# EasyEDA Pro project ProPrj_&lt;开源&gt;牧田款工具锂电池包主动均衡保护板_2024-07-21.epro

# Schematic Schematic1
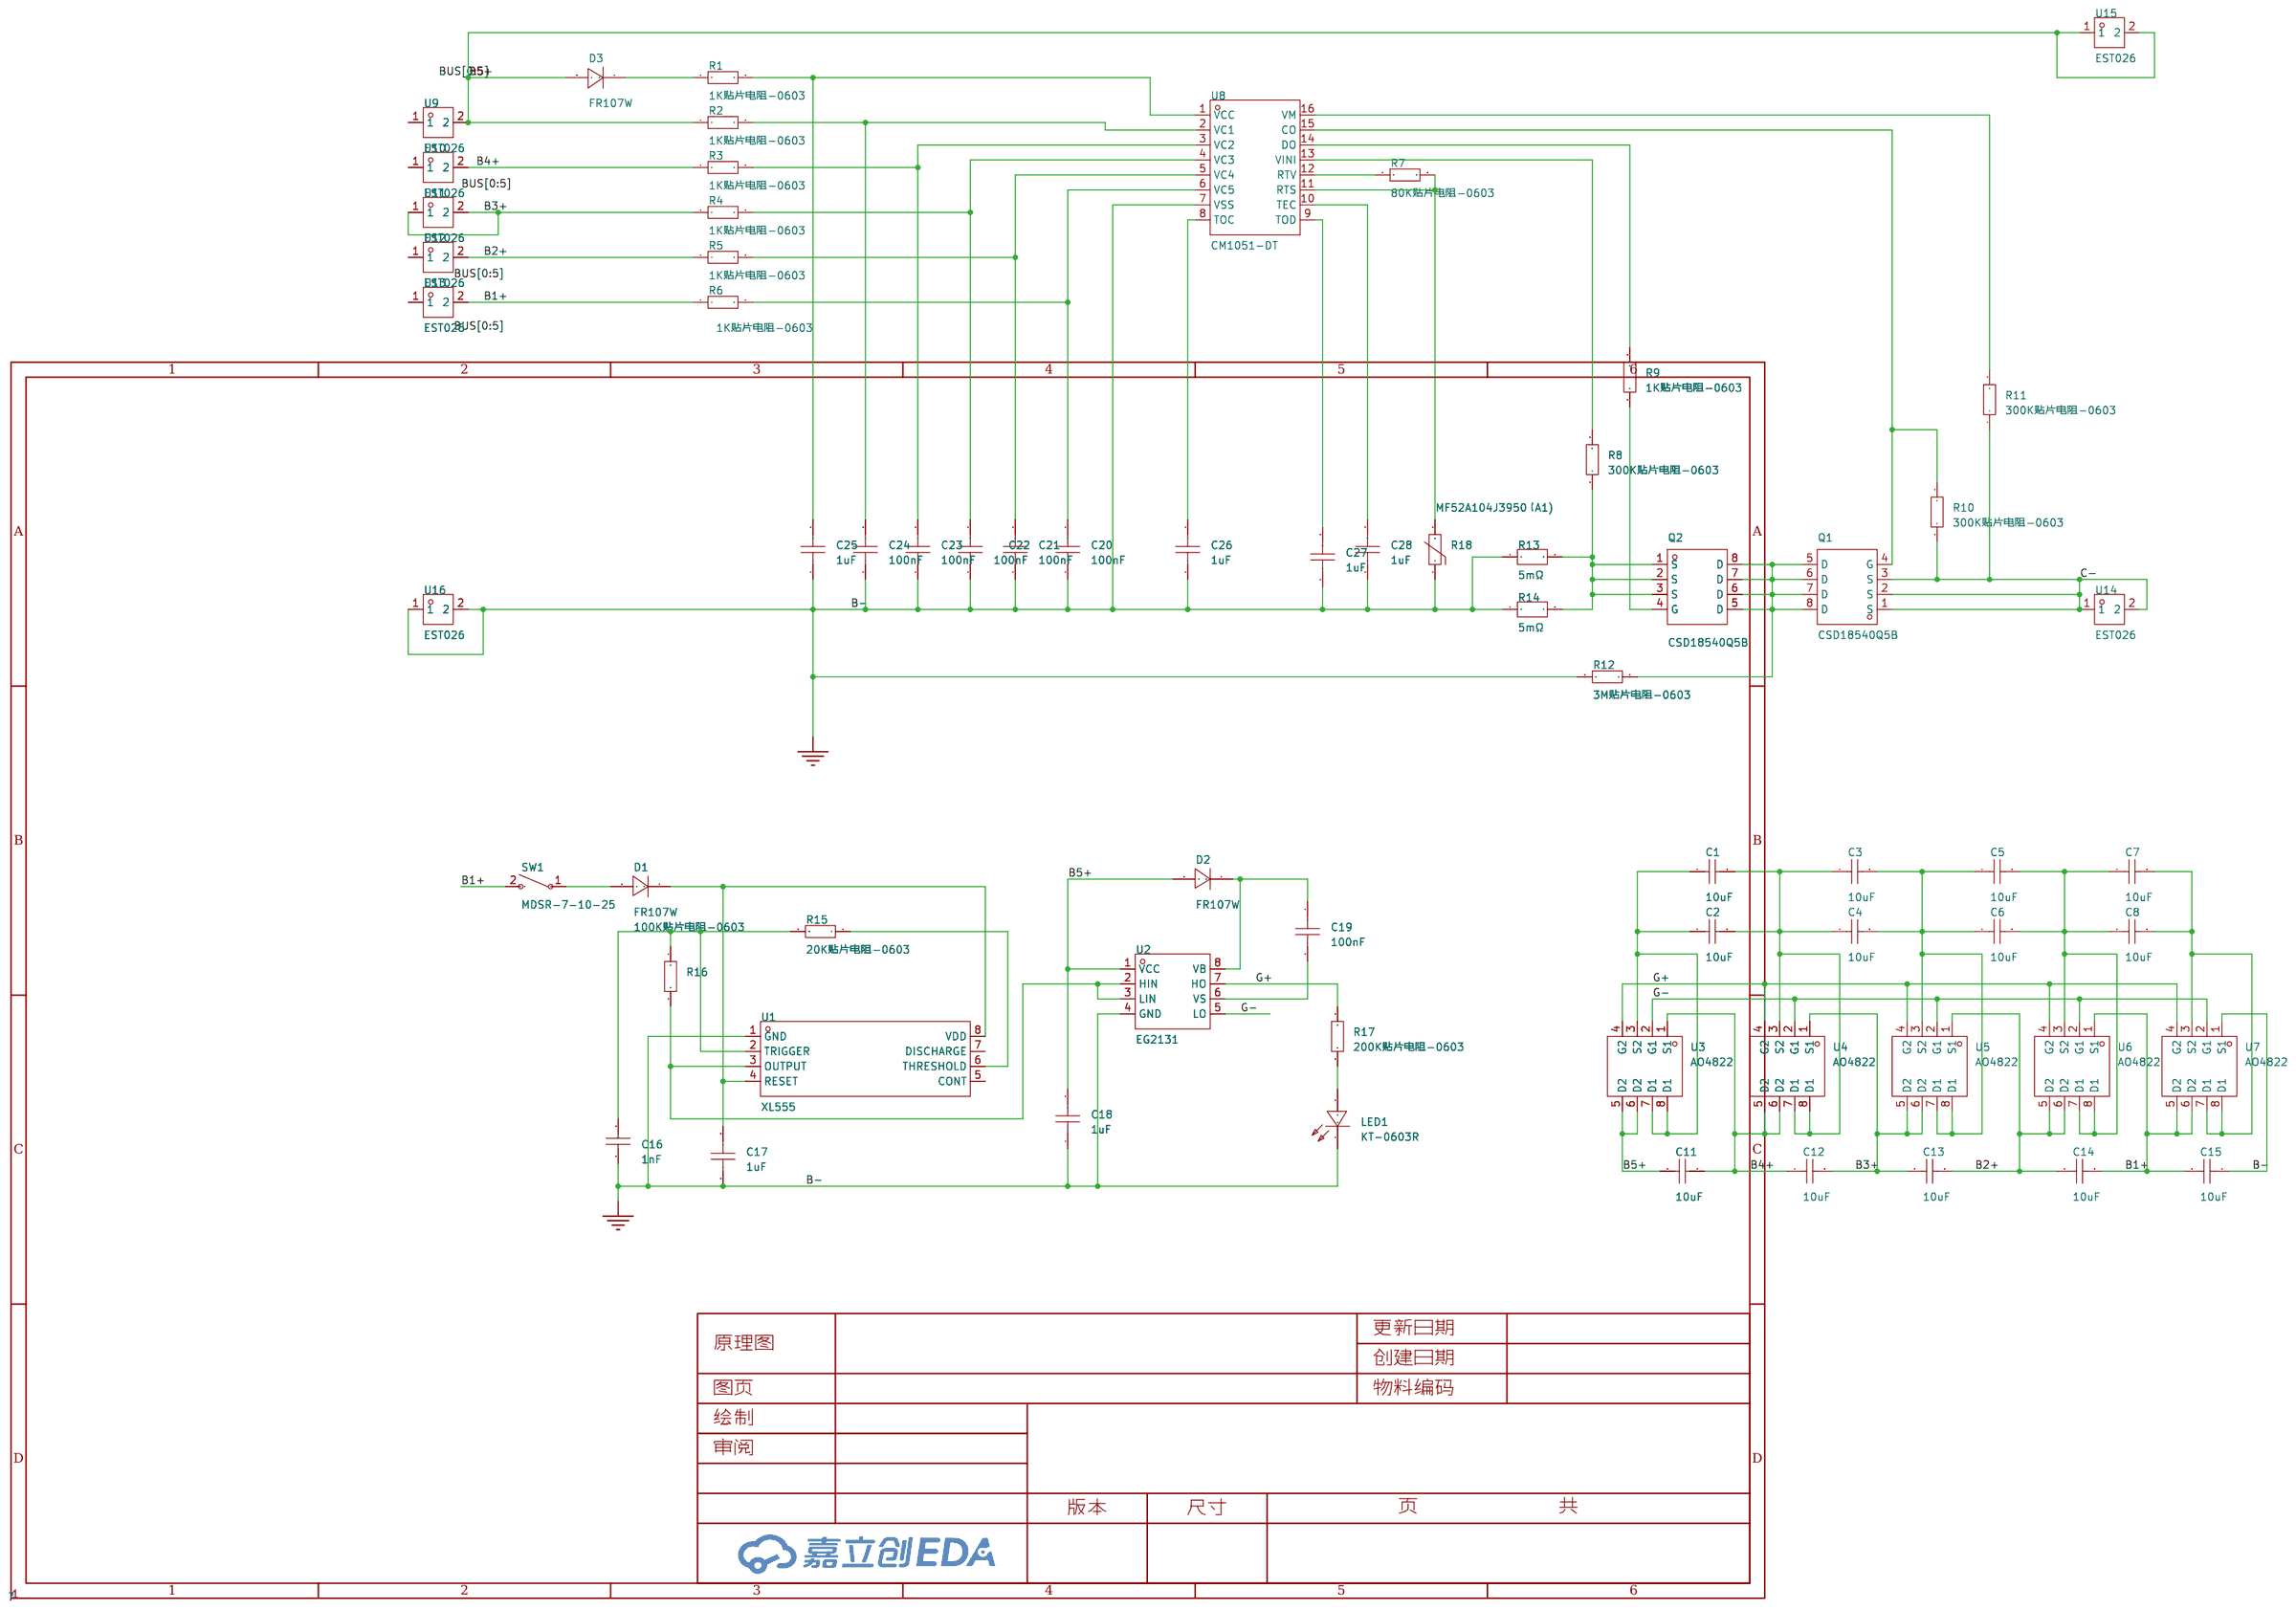
[diagram p0: schematic sheet]

## Parts
C1  10uF  [C1206]
C2  10uF  [C1206]
C3  10uF  [C1206]
C4  10uF  [C1206]
C5  10uF  [C1206]
C6  10uF  [C1206]
C7  10uF  [C1206]
C8  10uF  [C1206]
C11  10uF  [C1206]
C12  10uF  [C1206]
C13  10uF  [C1206]
C14  10uF  [C1206]
C15  10uF  [C1206]
C16  1nF  [C0603]
C17  1uF  [C0603]
C18  1uF  [C0603]
C19  100nF  [C0603]
C20  100nF  [C0603]
C21  100nF  [C0603]
C22  100nF  [C0603]
C23  100nF  [C0603]
C24  100nF  [C0603]
C25  1uF  [C0603]
C26  1uF  [C0603]
C27  1uF  [C0603]
C28  1uF  [C0603]
D1  FR107W  [SOD-123F_L2.8-W1.8-LS3.7-RD]
D2  FR107W  [SOD-123F_L2.8-W1.8-LS3.7-RD]
D3  FR107W  [SOD-123F_L2.8-W1.8-LS3.7-RD]
LED1  KT-0603R  [LED0603-RD]
Q1  CSD18540Q5B  [VSON-CLIP-8_L5.0-W6.0-P1.27-BL]
Q2  CSD18540Q5B  [VSON-CLIP-8_L5.0-W6.0-P1.27-BL]
R1  1K贴片电阻-0603  [R0603]
R2  1K贴片电阻-0603  [R0603]
R3  1K贴片电阻-0603  [R0603]
R4  1K贴片电阻-0603  [R0603]
R5  1K贴片电阻-0603  [R0603]
R6  1K贴片电阻-0603  [R0603]
R7  80K贴片电阻-0603  [R0603]
R8  300K贴片电阻-0603  [R0603]
R9  1K贴片电阻-0603  [R0603]
R10  300K贴片电阻-0603  [R0603]
R11  300K贴片电阻-0603  [R0603]
R12  3M贴片电阻-0603  [R0603]
R13  5mΩ  [RES-SMD_L6.4-W3.2-R2512]
R14  5mΩ  [RES-SMD_L6.4-W3.2-R2512]
R15  20K贴片电阻-0603  [R0603]
R16  100K贴片电阻-0603  [R0603]
R17  200K贴片电阻-0603  [R0603]
R18  MF52A104J3950（A1)  [RES-TH_L2.5-W2.5-P1.70-D0.3]
SW1  MDSR-7-10-25  [SW-TH_L12.7-W1.8-P17.7-L]
U1  XL555  [SOP-8_L5.0-W4.0-P1.27-LS6.0-BL]
U2  EG2131  [SOP-8_L4.9-W3.9-P1.27-LS6.0-BL]
U3  AO4822  [SOP-8_L5.1-W3.9-P1.27-LS6.0-BL]
U4  AO4822  [SOP-8_L5.1-W3.9-P1.27-LS6.0-BL]
U5  AO4822  [SOP-8_L5.1-W3.9-P1.27-LS6.0-BL]
U6  AO4822  [SOP-8_L5.1-W3.9-P1.27-LS6.0-BL]
U7  AO4822  [SOP-8_L5.1-W3.9-P1.27-LS6.0-BL]
U8  CM1051-DT  [TSSOP-16_L5.0-W4.4-P0.64-LS6.4-BL]
U9  EST026  [CONN-TH_L6.3-W0.8-EST026]
U10  EST026  [CONN-TH_L6.3-W0.8-EST026]
U11  EST026  [CONN-TH_L6.3-W0.8-EST026]
U12  EST026  [CONN-TH_L6.3-W0.8-EST026]
U13  EST026  [CONN-TH_L6.3-W0.8-EST026]
U14  EST026  [CONN-TH_L6.3-W0.8-EST026]
U15  EST026  [CONN-TH_L6.3-W0.8-EST026]
U16  EST026  [CONN-TH_L6.3-W0.8-EST026]

## Library data of the parts
C1-C8 C11-C15 = CL31A106KBHNNNE: 容值:10uF;精度:±10%;额定电压:50V;材质(温度系数):X5R;; LCSC Part Name: 10uF ±10% 50V; Supplier Part: C13585; Manufacturer: SAMSUNG(三星); Supplier Footprint: 1206; JLCPCB Part Class: 基础库; Datasheet: https://atta.szlcsc.com/upload/public/pdf/source/20160218/1457707763339.pdf; Supplier: LCSC; Tolerance: ±10%; Voltage Rated: 50V; Temperature Coefficient: X5R
C16 = CL10B102KB8NNNC: 容值:1nF;精度:±10%;额定电压:50V;材质(温度系数):X7R;; LCSC Part Name: 1nF ±10% 50V; Supplier Part: C1588; Manufacturer: SAMSUNG(三星); Supplier Footprint: 0603; JLCPCB Part Class: 基础库; Datasheet: https://atta.szlcsc.com/upload/public/pdf/source/20160218/1457707763339.pdf; Supplier: LCSC; Tolerance: ±10%; Voltage Rated: 50V; Temperature Coefficient: X7R
C17 C18 = CL10A105KB8NNNC: 容值:1uF;精度:±10%;额定电压:50V;材质(温度系数):X5R;; LCSC Part Name: 1uF ±10% 50V; Supplier Part: C15849; Manufacturer: SAMSUNG(三星); Supplier Footprint: 0603; JLCPCB Part Class: 基础库; Datasheet: https://atta.szlcsc.com/upload/public/pdf/source/20160218/1457707763339.pdf; Supplier: LCSC; Tolerance: ±10%; Voltage Rated: 50V; Temperature Coefficient: X5R
C19-C28 = CC0603KRX7R9BB104: 容值:100nF;精度:±10%;额定电压:50V;材质(温度系数):X7R;; LCSC Part Name: 100nF ±10% 50V; Supplier Part: C14663; Manufacturer: YAGEO(国巨); Supplier Footprint: 0603; JLCPCB Part Class: 基础库; Datasheet: https://atta.szlcsc.com/upload/public/pdf/source/20180910/C282072_33301C7F631E79921B82A8DAC6BCC5B3.pdf; Supplier: LCSC; Tolerance: ±10%; Voltage Rated: 50V; Temperature Coefficient: X7R
D1-D3 = FR107W_C108820: 二极管配置:独立式;正向压降(Vf):1.3V@1A;直流反向耐压(Vr):1kV;平均整流电流(Io):1A;反向恢复时间(trr):500ns;; LCSC Part Name: 电压:1kV 电流:1A; Supplier Part: C108820; Manufacturer: 晶导微电子; Supplier Footprint: SOD-123F; JLCPCB Part Class: 扩展库; Datasheet: https://atta.szlcsc.com/upload/public/pdf/source/20180125/C169510_15168663723441303211.pdf; Supplier: LCSC; Diode Configuration: 独立式; Forward Voltage (Vf@If): 1.3V@1A; Reverse Voltage (Vr): 1kV; Average Rectified Current (Io): 1A; Reverse Leakage Current: 5uA@1kV; Reverse Recovery Time (trr): 500ns; Operating Temperature: -55℃~+150℃@(Tj)
LED1 = KT-0603R: 发光颜色:红色;功率:-;正向电流:-;主波长:-;二极管配置:-;透镜颜色:-;色温:-;发光角度:-;载带方式:-;工作温度:-40℃~+85℃;; LCSC Part Name: 0603 红灯 高亮; Supplier Part: C2286; Manufacturer: KENTO; Supplier Footprint: 0603; JLCPCB Part Class: 基础库; Datasheet: https://atta.szlcsc.com/upload/public/pdf/source/20160616/1466072038404.pdf; Supplier: LCSC; Emitted Color: 红色; Operating Temperature: -40℃~+85℃
Q1 Q2 = CSD18540Q5B: 类型:1个N沟道;漏源电压(Vdss):60V;连续漏极电流(Id):100A;功率(Pd):3.1W；195W;导通电阻(RDS(on)@Vgs,Id):2.2mΩ@10V,28A;阈值电压(Vgs(th)@Id):2.3V@250uA;; LCSC Part Name: 1个N沟道 耐压:60V 电流:100A; Supplier Part: C86513; Manufacturer: TI(德州仪器); Supplier Footprint: VSON-8(5x6); JLCPCB Part Class: 扩展库; Datasheet: https://www.ti.com/cn/lit/gpn/csd18540q5b; Supplier: LCSC; Type: 1个N沟道; Drain Source Voltage (Vdss): 60V; Continuous Drain Current (Id): 100A; Power Dissipation (Pd): 3.1W；195W; Drain Source On Resistance (RDS(on)@Vgs,Id): 2.2mΩ@10V,28A; Gate Threshold Voltage (Vgs(th)@Id): 2.3V@250uA; Total Gate Charge (Qg@Vgs): 53nC@10V; Input Capacitance (Ciss@Vds): 4.23nF@30V; Operating Temperature: -55℃~+150℃@(Tj)
R1-R12 R15-R17 = 3.8K贴片电阻-0603: Supplier Part: C9900007582; JLCPCB Part Class: 扩展库; Supplier: LCSC
R13 R14 = HQR2512R005W2A1: 电阻类型:-;阻值:5mΩ;精度:±1%;功率:2W;最大工作电压:-;温度系数:±50ppm/℃;; LCSC Part Name: 5mΩ ±1% 2W; Supplier Part: C2931965; Supplier Footprint: 2512; JLCPCB Part Class: 扩展库; Datasheet: https://atta.szlcsc.com/upload/public/pdf/source/20220110/B8A3124FF9264482531488F12AEFBCB4.pdf; Supplier: LCSC; Tolerance: ±1%; Power(Watts): 2W; Temperature Coefficient: ±50ppm/℃; Operating Temperature Range: -55℃~+170℃
R18 = MF52A104J3950（A1): 阻值(25℃):100kΩ;B值(25℃/50℃):3950K;电阻精度:±5%;功率:50mW;B值精度:±1%;最大稳态电流(25℃):-;; LCSC Part Name: 100kΩ 电阻精度:±5% 3950K; Supplier Part: C123383; Manufacturer: 时恒; Supplier Footprint: 插件,P=1.7mm; JLCPCB Part Class: 扩展库; Datasheet: https://atta.szlcsc.com/upload/public/pdf/source/20170728/C123383_1501225824687848946.pdf; Supplier: LCSC; Resistance @ 25℃: 100kΩ; B Constant (25℃/50℃): 3950K; Resistance Tolerance: ±5%; Power: 50mW; B Constant Tolerance: ±1%; Operating Temperature: -55℃~+125℃
SW1 = MDSR-7-10-25: Supplier Part: C3716143; Manufacturer: Littelfuse(美国力特); Supplier Footprint: 插件; JLCPCB Part Class: 扩展库; Supplier: LCSC
U1 = XL555: 计时器/振荡器(单路) 频率：2.1MHz 工作电压：2V~15V 工作电流：360uA  2.1MHz、250μA、低功耗计时器; Supplier Part: C521186; Manufacturer: XINLUDA(信路达); Supplier Footprint: SOP-8; JLCPCB Part Class: 扩展库; Datasheet: https://atta.szlcsc.com/upload/public/pdf/source/20221209/C9374A4CCB9F66B44FE739BF0B6846CF.pdf; Supplier: LCSC
U2 = EG2131_C5240691: Supplier Part: C5240691; Manufacturer: EG(屹晶微); Supplier Footprint: SOP-8-150mil; JLCPCB Part Class: 扩展库; Datasheet: https://atta.szlcsc.com/upload/public/pdf/source/20180528/C193777_0A452F93B99FD4EB2A9D54E9055DABCE.pdf; Supplier: LCSC
U3-U7 = AO4822: 类型:2个N沟道;漏源电压(Vdss):30V;连续漏极电流(Id):8A;功率(Pd):2W;导通电阻(RDS(on)@Vgs,Id):19mΩ@10V,8A;; LCSC Part Name: 2个N沟道 耐压:30V 电流:8A; Supplier Part: C5183841; Manufacturer: JSMSEMI(杰盛微); Supplier Footprint: SOP-8; JLCPCB Part Class: 扩展库; Datasheet: https://atta.szlcsc.com/upload/public/pdf/source/20240105/835C5C96DC4808FE4C186BA7BD34E0CD.pdf; Supplier: LCSC; Type: 2个N沟道; Drain Source Voltage (Vdss): 30V; Continuous Drain Current (Id): 8A; Power Dissipation (Pd): 2W; Drain Source On Resistance (RDS(on)@Vgs,Id): 19mΩ@10V,8A
U8 = CM1051-DT: LCSC Part Name: 多节保护IC; Supplier Part: C2685529; Manufacturer: iCM(创芯微); Supplier Footprint: TSSOP-16-4.4mm; JLCPCB Part Class: 扩展库; Datasheet: https://atta.szlcsc.com/upload/public/pdf/source/20210126/C2685527_559F65FD4008A2C6057152C52AC2AC21.pdf; Supplier: LCSC
U9-U16 = EST026: 环保; LCSC Part Name: EST026 6.3mm*0.8厚 插片; Supplier Part: C52878; Manufacturer: xcfuse(旭程); Supplier Footprint: 插件; JLCPCB Part Class: 扩展库; Datasheet: https://atta.szlcsc.com/upload/public/pdf/source/20230706/FE0C67E6DF82D911EA75D8425B368591.pdf; Supplier: LCSC

## Nets
B1+: C14.2 C15.1 R6.1 SW1.2 U6.1(S1) U7.5(D2) U7.6(D2) U13.2
B2+: C13.2 C14.1 R5.1 U5.1(S1) U6.5(D2) U6.6(D2) U12.2
B3+: C12.2 C13.1 R4.1 U4.1(S1) U5.5(D2) U5.6(D2) U11.1 U11.2
B4+: C11.2 C12.1 R3.1 U3.1(S1) U4.5(D2) U4.6(D2) U10.2
B5+: C11.1 C18.2 D2.2(A) D3.2(A) R2.1 U2.1(VCC) U3.5(D2) U3.6(D2) U9.2 U15.1 U15.2
B-: C15.2 C16.1 C17.1 C18.1 C20.1 C21.1 C22.1 C23.1 C24.1 C25.1 C26.1 C27.1 C28.1 LED1.1(K) R12.2 R13.1 R14.1 R18.1 U1.1(GND) U2.4(GND) U7.1(S1) U8.7(VSS) U16.1 U16.2
C-: Q1.1(S) Q1.2(S) Q1.3(S) R10.2 R11.1 U14.1 U14.2
G+: R17.1 U2.7(HO) U3.4(G2) U4.4(G2) U5.4(G2) U6.4(G2) U7.4(G2)
G-: U2.5(LO) U3.2(G1) U4.2(G1) U5.2(G1) U6.2(G1) U7.2(G1)
$1N2288: R15.1 U1.6(THRESHOLD)
$1N2305: C16.2 R15.2 R16.1 U1.2(TRIGGER)
$1N2914: C19.1 D2.1(C) U2.8(VB)
$1N2918: C19.2 U2.6(VS)
$1N2923: LED1.2(A) R17.2
$1N3078: C1.2 C2.2 C3.1 C4.1 U4.3(S2) U4.7(D1) U4.8(D1)
$1N3116: C3.2 C4.2 C5.1 C6.1 U5.3(S2) U5.7(D1) U5.8(D1)
$1N3154: C5.2 C6.2 C7.1 C8.1 U6.3(S2) U6.7(D1) U6.8(D1)
$1N3504: C7.2 C8.2 U7.3(S2) U7.7(D1) U7.8(D1)
$1N4623: C1.1 C2.1 U3.3(S2) U3.7(D1) U3.8(D1)
$1N5005: C26.2 U8.8(TOC)
$1N5133: C25.2 R1.2 U8.1(VCC)
$1N5140: D3.1(C) R1.1
$1N5163: C24.2 R2.2 U8.2(VC1)
$1N5170: C23.2 R3.2 U8.3(VC2)
$1N5177: C22.2 R4.2 U8.4(VC3)
$1N5184: C21.2 R5.2 U8.5(VC4)
$1N5194: C20.2 R6.2 U8.6(VC5)
$1N5371: C27.2 U8.9(TOD)
$1N5430: C28.2 U8.10(TEC)
$1N5516: R7.1 U8.12(RTV)
$1N5520: R7.2 R18.2 U8.11(RTS)
$1N5630: Q2.1(S) Q2.2(S) Q2.3(S) R8.1 R13.2 R14.2
$1N5637: R8.2 U8.13(VINI)
$1N5652: Q2.4(G) R9.1
$1N5657: R9.2 U8.14(DO)
$1N5714: Q1.5(D) Q1.6(D) Q1.7(D) Q1.8(D) Q2.5(D) Q2.6(D) Q2.7(D) Q2.8(D) R12.1
$1N5821: Q1.4(G) R10.1 U8.15(CO)
$1N5879: R11.2 U8.16(VM)
$1N6186: D1.2(A) SW1.1
$1N7988: R16.2 U1.3(OUTPUT) U2.2(HIN) U2.3(LIN)
$1N8013: C17.2 D1.1(C) U1.4(RESET) U1.8(VDD)

Not connected (* = marked no-connect by the designer): U1 5(CONT) 7(DISCHARGE); U9 1; U10 1; U12 1; U13 1

# Board PCB1
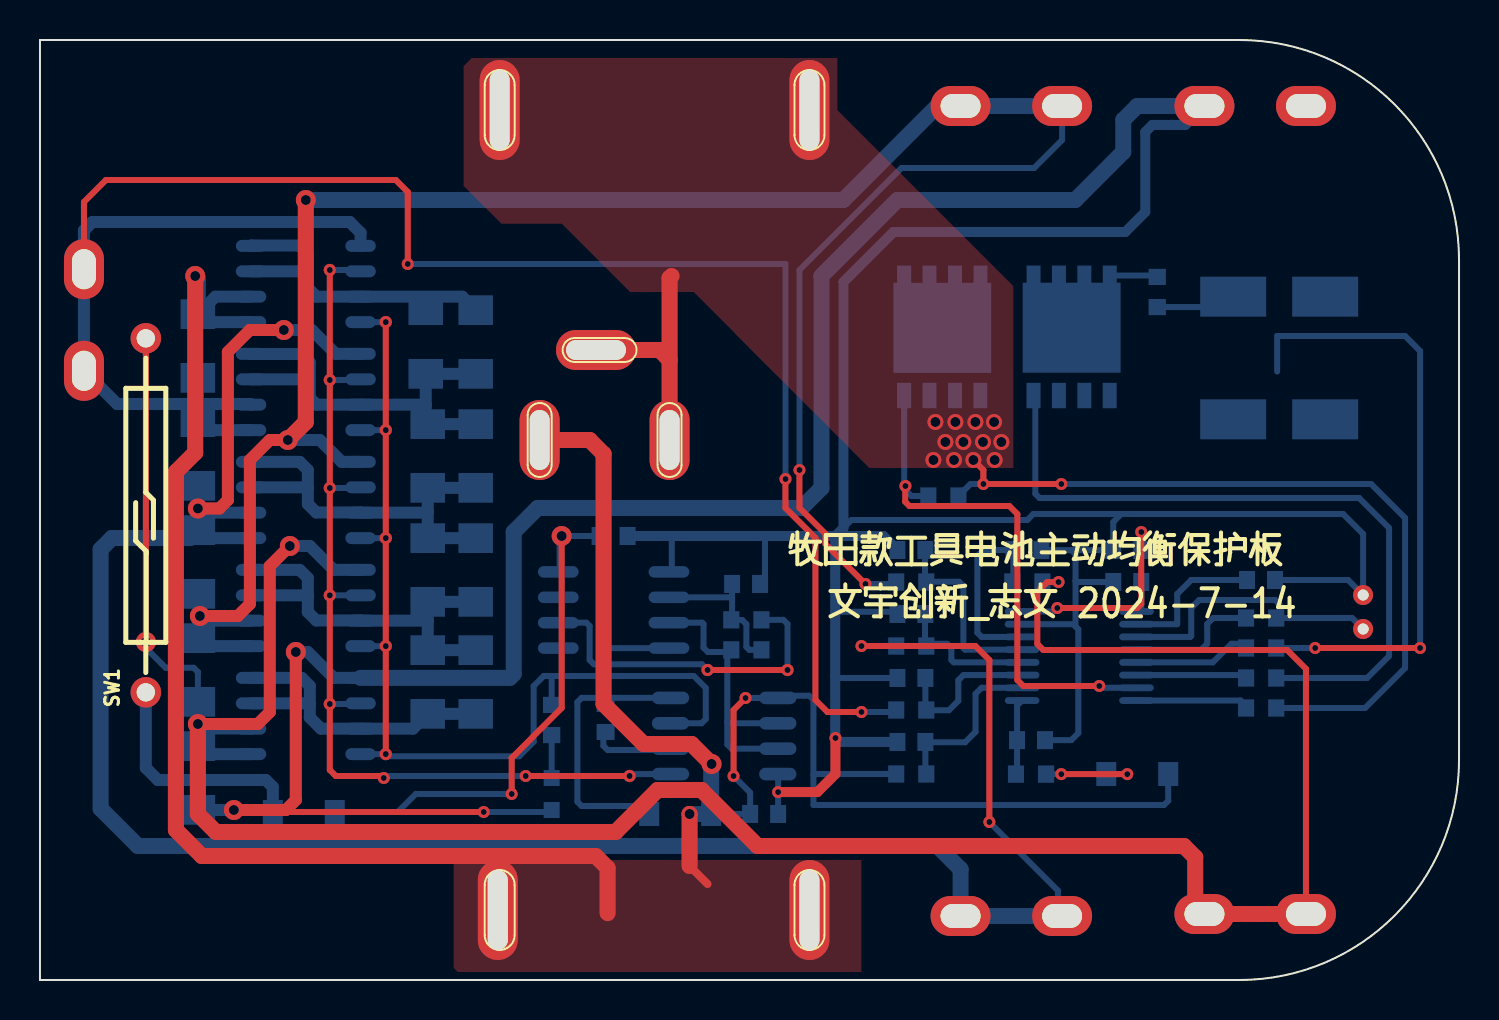
[diagram p1: board, top side]
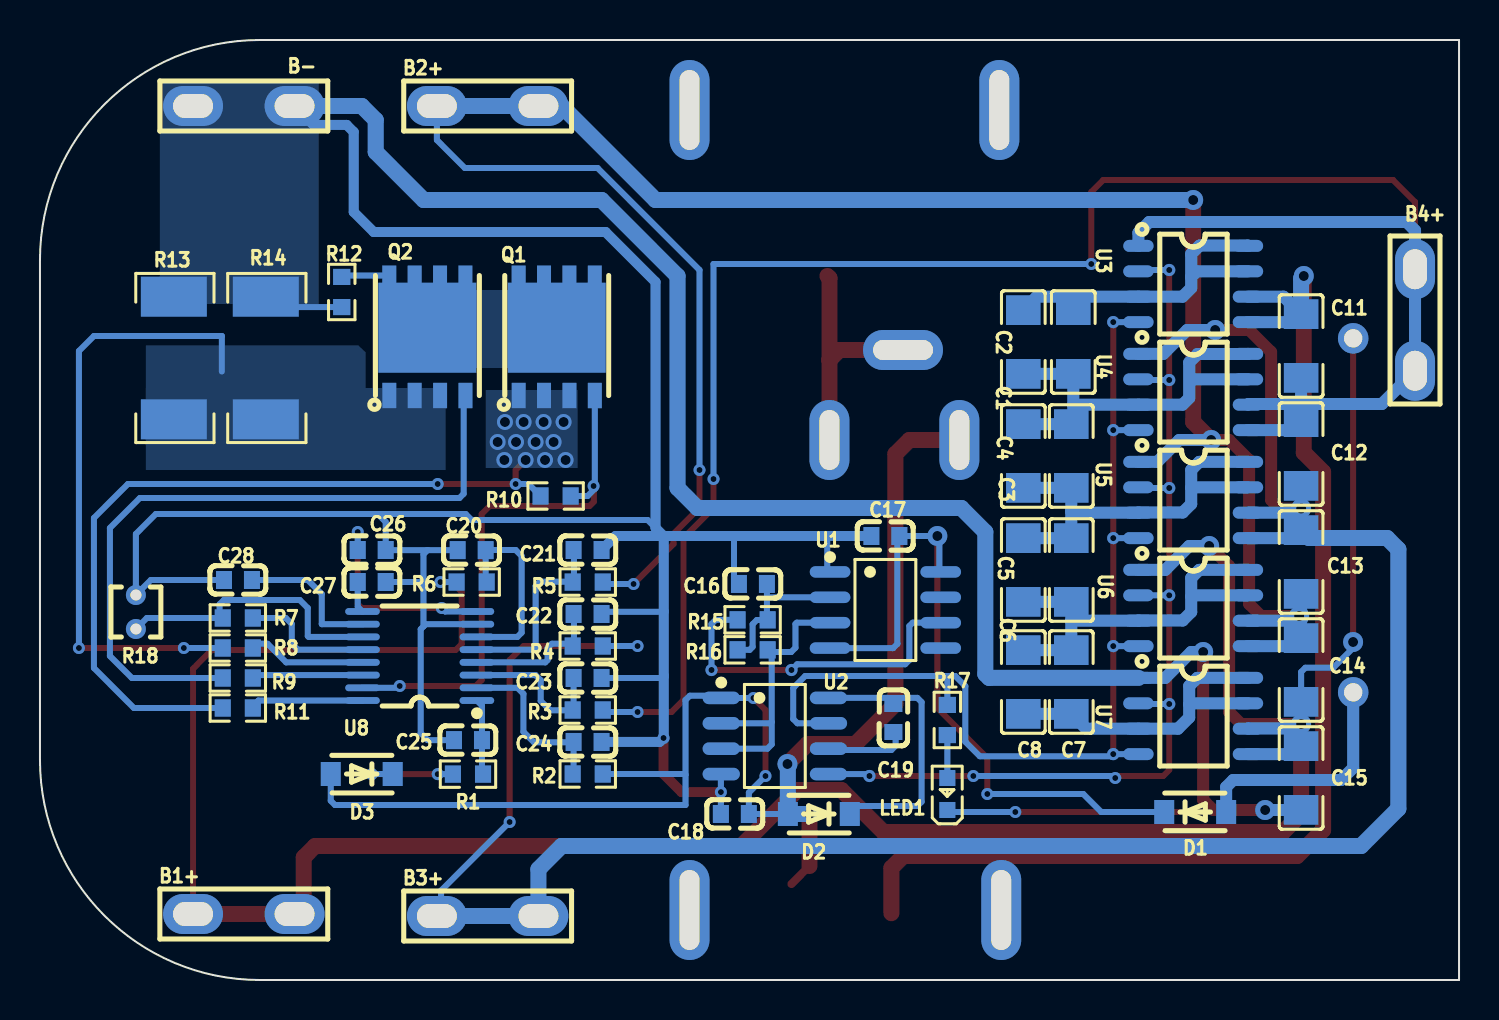
[diagram p2: board, bottom side, seen from below]

Outline 71 x 47 mm; copper layers: Top Layer, Bottom Layer. Coordinates in mm from the lower left corner of the outline.
Outline path: 0,47 0,0 60,0 arc(67.78,3.22) 71,11 71,36 arc(67.78,43.78) 60,47 0,47
Stack: Top Layer 0.035mm / Dielectric1 1.51mm FR4 er 4.5 / Bottom Layer 0.035mm

## Design rules (mm)
template: JLCPCB Capability(Two Layers Board)
spacing copperThickness1oz (default): track to track 0.102, other pairs 0.152 to 0.3
spacing copperThickness2oz: track to track 0.203, other pairs 0.152 to 0.3
track width copperThickness1oz (default): min 0.127, default 0.254, max 2.54
track width copperThickness2oz: min 0.203, default 0.254, max 2.54
differential pair differentialPair (default): width min 0.127, default 0.254, max 2.54; gap min 0.152, default 0.152
via viaSize (default): diameter min 0.5, default 0.61, max 10; hole min 0.3, default 0.305, max 6.3

## Placement (name value [footprint] x y rotation side)
B1+  EST026  [CONN-TH_L6.3-W0.8-EST026]  60.8 3.3 180 bottom
B2+  EST026  [CONN-TH_L6.3-W0.8-EST026]  48.6 43.7 180 bottom
B3+  EST026  [CONN-TH_L6.3-W0.8-EST026]  48.6 3.2 180 bottom
B4+  EST026  [CONN-TH_L6.3-W0.8-EST026]  2.2 33 270 bottom
B-  EST026  [CONN-TH_L6.3-W0.8-EST026]  60.8 43.7 180 bottom
C1  10uF  [C1206]  21.8 31.9 270 bottom
C2  10uF  [C1206]  19.3 31.9 270 bottom
C3  10uF  [C1206]  19.4 26.2 270 bottom
C4  10uF  [C1206]  21.8 26.2 270 bottom
C5  10uF  [C1206]  19.4 20.5 270 bottom
C6  10uF  [C1206]  21.8 20.5 270 bottom
C7  10uF  [C1206]  19.4 14.9 270 bottom
C8  10uF  [C1206]  21.8 14.9 270 bottom
C11  10uF  [C1206]  7.9 31.7 270 bottom
C12  10uF  [C1206]  7.9 26.3 270 bottom
C13  10uF  [C1206]  7.9 20.9 270 bottom
C14  10uF  [C1206]  7.9 15.5 270 bottom
C15  10uF  [C1206]  7.9 10.1 270 bottom
C16  1nF  [C0603]  35.33 19.8 180 bottom
C17  1uF  [C0603]  28.7 22.2 180 bottom
C18  1uF  [C0603]  36.23 8.3 180 bottom
C19  100nF  [C0603]  28.3 13.1 270 bottom
C20  100nF  [C0603]  49.4 21.49 180 bottom
C21  100nF  [C0603]  43.6 21.5 0 bottom
C22  100nF  [C0603]  43.6 18.3 0 bottom
C23  100nF  [C0603]  43.6 15.1 0 bottom
C24  100nF  [C0603]  43.6 11.9 0 bottom
C25  1uF  [C0603]  49.59 11.99 180 bottom
C26  1uF  [C0603]  54.4 21.5 0 bottom
C27  1uF  [C0603]  54.4 19.9 0 bottom
C28  1uF  [C0603]  61.09 20 180 bottom
D1  FR107W  [SOD-123F_L2.8-W1.8-LS3.7-RD]  13.2 8.4 180 bottom
D2  FR107W  [SOD-123F_L2.8-W1.8-LS3.7-RD]  32.03 8.3 0 bottom
D3  FR107W  [SOD-123F_L2.8-W1.8-LS3.7-RD]  54.9 10.3 0 bottom
LED1  KT-0603R  [LED0603-RD]  25.6 9.3 90 bottom
NOREF  -  [Pad_e1405]  27.82 31.5 90 top
NOREF#2  -  [Pad_e1399]  38.5 43.5 0 top
NOREF#3  -  [Pad_e1404]  25 27 0 top
NOREF#4  -  [Pad_e1400]  23 43.5 0 top
NOREF#5  -  [Pad_e1403]  31.5 27 0 top
NOREF#6  -  [Pad_e1401]  38.5 3.5 0 top
NOREF#7  -  [Pad_e1402]  22.9 3.5 0 top
Q1  CSD18540Q5B  [VSON-CLIP-8_L5.0-W6.0-P1.27-BL]  45.14 32.22 180 bottom
Q2  CSD18540Q5B  [VSON-CLIP-8_L5.0-W6.0-P1.27-BL]  51.62 32.22 180 bottom
R1  1K贴片电阻-0603  [R0603]  49.59 10.29 180 bottom
R2  1K贴片电阻-0603  [R0603]  43.59 10.3 0 bottom
R3  1K贴片电阻-0603  [R0603]  43.59 13.5 0 bottom
R4  1K贴片电阻-0603  [R0603]  43.59 16.7 0 bottom
R5  1K贴片电阻-0603  [R0603]  43.59 19.9 0 bottom
R6  1K贴片电阻-0603  [R0603]  49.4 19.9 180 bottom
R7  80K贴片电阻-0603  [R0603]  61.1 18.1 0 bottom
R8  300K贴片电阻-0603  [R0603]  61.1 16.6 180 bottom
R9  1K贴片电阻-0603  [R0603]  61.1 15.1 180 bottom
R10  300K贴片电阻-0603  [R0603]  45.2 24.2 0 bottom
R11  300K贴片电阻-0603  [R0603]  61.1 13.6 180 bottom
R12  3M贴片电阻-0603  [R0603]  55.9 34.4 270 bottom
R13  5mΩ  [RES-SMD_L6.4-W3.2-R2512]  64.3 31.1 270 bottom
R14  5mΩ  [RES-SMD_L6.4-W3.2-R2512]  59.7 31.1 270 bottom
R15  20K贴片电阻-0603  [R0603]  35.34 18.01 180 bottom
R16  100K贴片电阻-0603  [R0603]  35.34 16.51 180 bottom
R17  200K贴片电阻-0603  [R0603]  25.6 13 270 bottom
R18  MF52A104J3950（A1)  [RES-TH_L2.5-W2.5-P1.70-D0.3]  66.2 18.4 270 bottom
SW1  MDSR-7-10-25  [SW-TH_L12.7-W1.8-P17.7-L]  5.3 23.23 90 top
U1  XL555  [SOP-8_L5.0-W4.0-P1.27-LS6.0-BL]  28.7 18.5 270 bottom
U2  EG2131  [SOP-8_L4.9-W3.9-P1.27-LS6.0-BL]  34.23 12.2 270 bottom
U3  AO4822  [SOP-8_L5.1-W3.9-P1.27-LS6.0-BL]  13.3 34.8 270 bottom
U4  AO4822  [SOP-8_L5.1-W3.9-P1.27-LS6.0-BL]  13.3 29.4 270 bottom
U5  AO4822  [SOP-8_L5.1-W3.9-P1.27-LS6.0-BL]  13.3 24 270 bottom
U6  AO4822  [SOP-8_L5.1-W3.9-P1.27-LS6.0-BL]  13.3 18.6 270 bottom
U7  AO4822  [SOP-8_L5.1-W3.9-P1.27-LS6.0-BL]  13.3 13.2 270 bottom
U8  CM1051-DT  [TSSOP-16_L5.0-W4.4-P0.64-LS6.4-BL]  52 16.2 90 bottom

## Footprints (pads in the part's own frame, mm; a bottom-side part is the same pattern mirrored in y, then rotated)
C0603
  rect 0.8x0.9 smd: 1(-0.7,0) 2(0.7,0)
C1206
  rect 1.485x1.728 smd: 1(-1.593,0) 2(1.593,0)
CONN-TH_L6.3-W0.8-EST026
  oval 3x2 hole 2x1.2: 1(-2.54,0) 2(2.54,0)
LED0603-RD
  rect 0.8x0.8 smd: 1(-0.799,0) 2(0.799,0)
Pad_e1399
  oval 2x5 hole 1x4: 1(0,0)
Pad_e1400
  oval 2x5 hole 1x4: 1(0,0)
Pad_e1401
  oval 2x5 hole 1x4: 1(0,0)
Pad_e1402
  oval 2x5 hole 1x4: 1(0,0)
Pad_e1403
  oval 2x4 hole 1x3: 1(0,0)
Pad_e1404
  oval 2x4 hole 1x3: 1(0,0)
Pad_e1405
  oval 2x4 hole 1x3: 1(0,0)
R0603
  rect 0.806x0.864 smd: 1(-0.753,0) 2(0.753,0)
RES-SMD_L6.4-W3.2-R2512
  rect 2x3.3 smd: 1(-3.067,0) 2(3.067,0)
RES-TH_L2.5-W2.5-P1.70-D0.3
  round 1 hole 0.55: 1(-0.85,0) 2(0.85,0)
SOD-123F_L2.8-W1.8-LS3.7-RD
  rect 1x1.2 smd: 1(-1.55,0) 2(1.55,0)
SOP-8_L4.9-W3.9-P1.27-LS6.0-BL
  oval 0.63x1.865 smd: 1(-1.905,-2.683) 2(-0.635,-2.683) 3(0.635,-2.683) 4(1.905,-2.683) 5(1.905,2.683) 6(0.635,2.683) 7(-0.635,2.683) 8(-1.905,2.683)
SOP-8_L5.0-W4.0-P1.27-LS6.0-BL
  oval 0.574x2.035 smd: 1(-1.905,-2.768) 2(-0.635,-2.768) 3(0.635,-2.768) 4(1.905,-2.768) 5(1.905,2.768) 6(0.635,2.768) 7(-0.635,2.768) 8(-1.905,2.768)
SOP-8_L5.1-W3.9-P1.27-LS6.0-BL
  oval 0.6x1.52 smd: 1(-1.905,-2.74) 2(-0.635,-2.74) 3(0.635,-2.74) 4(1.905,-2.74) 5(1.905,2.74) 6(0.635,2.74) 7(-0.635,2.74) 8(-1.905,2.74)
SW-TH_L12.7-W1.8-P17.7-L
  round 1.524 hole 0.914: 1(-8.85,0) 2(8.85,0)
TSSOP-16_L5.0-W4.4-P0.64-LS6.4-BL
  oval 0.343x1.732 smd: 1(-2.226,-2.862) 2(-1.59,-2.862) 3(-0.954,-2.862) 4(-0.318,-2.862) 5(0.318,-2.862) 6(0.954,-2.862) 7(1.59,-2.862) 8(2.226,-2.862) 9(2.226,2.862) 10(1.59,2.862) 11(0.954,2.862) 12(0.318,2.862) 13(-0.318,2.862) 14(-0.954,2.862) 15(-1.59,2.862) 16(-2.226,2.862)
VSON-CLIP-8_L5.0-W6.0-P1.27-BL
  rect 0.7x1.27 smd: 1(-1.904,-3) 2(-0.636,-3) 3(0.636,-3) 4(1.906,-3)
  rect 0.7x1 smd: 5(1.904,3) 6(0.634,3) 7(-0.636,3) 8(-1.906,3)
  rect 4.9x4.5 smd: 8(-0.001,0.39)

## Nets
As in the schematic, except:
B1+: B1+.1 B1+.2 C14.2 C15.1 R6.1 SW1.2 U6.1 U7.5 U7.6
B2+: B2+.1 B2+.2 C13.2 C14.1 R5.1 U5.1 U6.5 U6.6
B3+: B3+.1 B3+.2 C12.2 C13.1 R4.1 U4.1 U5.5 U5.6
B4+: B4+.1 B4+.2 C11.2 C12.1 R3.1 U3.1 U4.5 U4.6
B5+: C11.1 C18.2 D2.2 D3.2 NOREF#3.1 NOREF#6.1 NOREF#7.1 R2.1 U2.1 U3.5 U3.6
B-: B-.1 B-.2 C15.2 C16.1 C17.1 C18.1 C20.1 C21.1 C22.1 C23.1 C24.1 C25.1 C26.1 C27.1 C28.1 LED1.1 R12.2 R13.1 R14.1 R18.1 U1.1 U2.4 U7.1 U8.7
C-: NOREF.1 NOREF#2.1 NOREF#4.1 NOREF#5.1 Q1.1 Q1.2 Q1.3 R10.2 R11.1

Pads without a net: U1 5 7

## Via types
v1: diameter 0.6, hole 0.3, Top Layer to Bottom Layer, 26 vias
v2: diameter 1, hole 0.5, Top Layer to Bottom Layer, 13 vias
v3: diameter 0.8, hole 0.5, Top Layer to Bottom Layer, 13 vias
v4: diameter 0.61, hole 0.305, Top Layer to Bottom Layer, 13 vias

## Routing (per net, layer and track width the routed paths; a pad name or vN(x,y) marks a point on that pad's centre or on a via; arc(x,y) is an arc through that point)
B1+: length 140.3
  Top Layer w0.3: v1(50.96,19.9) 50.4,19.9 49.9,19.4 49.9,16.8 50.2,16.5 62.4,16.5 63.34,15.56 B1+.1 ; SW1.2 5.3,32.08 v2(5.3,16.9)
  Top Layer w0.6: v2(7.9,12.8) 10.9,12.8 11.5,13.4 11.5,20.7 v2(12.5,21.7)
  Top Layer w0.8: B1+.1 B1+.2 57.8,3.76 57.8,6.13 57.24,6.7 35.9,6.7 33.1,9.5 30.9,9.5 28.8,7.4 8.8,7.4 7.9,8.3 v2(7.9,12.8)
  Bottom Layer w0.3: v2(5.3,16.9) 5.3,16.6 6.29,15.61 7.69,15.61 7.9,15.4 C14.2 ; R6.1 51,19.9
  Bottom Layer w0.6: 10.56,12.56 10.55,12.58 7.9,12.58 ; C14.2 7.9,12.58 ; 7.9,12.58 7.9,11.79 ; 10.56,11.29 8.3,11.29 C15.1 ; v2(12.5,21.7) 13.5,21.7 14.7,20.5 U6.1
B2+: length 112.4
  Top Layer w0.3: v1(41.3,19.8) 39.3,21.8 39.3,22.31 38,23.61 v1(38,25.5)
  Top Layer w0.6: v2(8,18.2) 9.9,18.2 10.5,18.8 10.5,26 11.5,27 v2(12.4,27)
  Top Layer w0.8: v2(12.4,27) 13.3,27.9 v2(13.3,39)
  Bottom Layer w0.3: B2+.1 51.14,42 49.74,40.6 43.1,40.6 38,35.5 v1(38,25.5) ; v1(41.3,19.8) 42.74,19.8 R5.1
  Bottom Layer w0.6: v2(12.4,27) 14,27 15.1,25.91 U5.1 ; 10.56,16.69 8.3,16.69 C14.1 C13.2 ; 10.56,17.96 7.91,17.96
  Bottom Layer w0.8: v2(13.3,39) 40.2,39 44.9,43.7 B2+.2 B2+.1
B3+: length 116.9
  Top Layer w0.3: v1(41.1,16.7) 46.8,16.7 47.5,16 v1(47.5,7.9)
  Top Layer w0.6: v2(7.9,23.58) 8.98,23.58 9.4,24 9.4,31.4 10.5,32.5 v2(12.2,32.5)
  Bottom Layer w0.3: R4.1 v1(41.1,16.7) ; 50.93,3.2 50.93,4.47 v1(47.5,7.9)
  Bottom Layer w0.6: U4.1 14.8,31.3 13.6,32.5 v2(12.2,32.5) ; 7.9,23.37 7.9,23.36 10.56,23.36 ; 7.9,23.37 C12.2 ; 7.9,23.37 C13.1 8.3,22.09 10.56,22.09
  Bottom Layer w0.8: C13.1 7.51,22.1 3.6,22.1 3.04,21.53 3.04,8.57 4.9,6.7 44.9,6.7 46.06,5.54 B3+.2 B3+.1
B4+: length 105.3
  Top Layer w0.3: v1(18.4,35.8) 18.4,39.4 17.8,40 3.3,40 2.2,38.9 B4+.1 ; v1(41.1,13.4) 39.4,13.4 38.8,14 38.8,22.1 37.3,23.6 v1(37.3,25.05)
  Bottom Layer w0.3: v1(18.4,35.8) 37.3,35.8 v1(37.3,25.05) ; R3.1 42.74,13.4 v1(41.1,13.4)
  Bottom Layer w0.6: C11.2 7.9,28.8 10.52,28.8 10.56,28.77 ; 10.56,27.49 8.3,27.49 C12.1 7.9,28.38 7.48,28.8 3.86,28.8 B4+.2 B4+.1 2.2,37.48 2.62,37.9 15.5,37.9 16.04,37.36 U3.1
B5+: length 131
  Top Layer w0.3: v1(35.3,14.1) 34.7,13.5 v1(34.7,10.2)
  Top Layer w0.4: 32.5,5.7 33.4,4.8
  Top Layer w0.8: v2(7.77,35.2) 7.77,26.37 6.8,25.4 6.8,7.5 8.1,6.2 27.8,6.2 28.4,5.6 28.4,3.34 ; NOREF#3.1 27.5,27 28.2,26.3 28.2,13.8 30.2,11.8 32.6,11.8 v2(33.6,10.8) ; v3(32.5,8.3) 32.5,5.7
  Bottom Layer w0.3: 38.7,10.26 38.74,10.3 42.78,10.3 ; 38.7,10.26 38.7,8.75 56.24,8.75 56.45,8.96 D3.2 ; 38.7,10.26 38.7,14 38.49,14.21 37.02,14.21 U2.1 36.91,14.1 v1(35.3,14.1) ; v1(34.7,10.2) 35.53,9.37 C18.2 D2.2
  Bottom Layer w0.6: 10.56,34.16 8.77,34.16 C11.1 8.3,32.89 10.56,32.89
  Bottom Layer w0.8: 33.58,8.3 v3(32.5,8.3) ; v2(33.6,10.8) 33.58,10.78 D2.2 ; C11.1 7.9,35.07 v2(7.77,35.2)
B-: length 236.9
  Top Layer w0.3: v1(22.2,8.4) 12.05,8.4 11.95,8.5
  Top Layer w0.5: v1(39.8,12.1) 39.8,10.3 38.9,9.4 v1(36.93,9.4)
  Top Layer w0.6: v2(12.8,16.4) 12.8,9 12.3,8.5 v2(9.7,8.5)
  Bottom Layer w0.3: 51.81,19.95 51.81,21.29 51.61,21.49 ; 51.81,19.95 51.81,17.68 ; 51.81,19.95 51.86,19.9 C27.1 ; 31.61,22.2 31.61,20.55 U1.1 ; 54.1,23.3 53.7,22.9 C26.1 53.7,21.49 51.61,21.49 ; 54.1,23.3 49.7,23.3 49.4,23 40.6,23 40.2,22.6 ; 54.1,23.3 65.2,23.3 66.2,22.3 R18.1 65.45,20 61.8,20 ; C22.1 42.79,18.41 39.79,18.41 ; LED1.1 25.5,8.4 v1(22.2,8.4) ; 51.61,21.49 C20.1 ; 51.81,17.68 51.7,17.79 U8.7 ; 51.81,17.68 51.95,17.54 51.95,12.34 51.6,11.99 C25.1 ; C16.1 36.27,20.05 36.27,22.2 ; R14.1 59.18,33.65 R12.2 ; C23.1 39.89,15.1 39.79,15.2 ; U2.4 36.93,10.28 v1(36.93,9.4) C18.1
  Bottom Layer w0.5: B-.2 57.31,42.75 55.65,42.75 55.3,42.4 55.3,38.4 54.3,37.4 42.7,37.4 40.2,34.9 40.2,22.6 39.8,22.2 ; 39.8,22.2 42.2,22.2 C21.1 ; 39.8,22.2 C17.1 ; 39.8,22.2 39.79,22.19 39.79,12.11 40,11.9 C24.1
  Bottom Layer w0.6: U7.1 14.7,15.1 13.4,16.4 v2(12.8,16.4) ; C15.2 7.91,8.5 v2(9.7,8.5)
  Bottom Layer w0.8: U7.1 23.51,15.1 23.7,15.3 23.7,22.4 24.9,23.6 38.1,23.6 39.1,24.6 39.1,35.2 42.9,39 51.8,39 54.2,41.4 54.2,43 54.9,43.7 B-.2
C-: length 51.5
  Top Layer w0.3: v1(51.1,24.8) v1(47.2,24.8) 47.2,25.5 v3(46.7,26)
  Top Layer w0.8: 31.5,31 31.5,35.1 31.6,35.2 ; 31.5,31 NOREF#5.1 ; 31.5,31 31,31.5 NOREF.1
  Bottom Layer w0.3: v1(47.2,24.8) 46.55,24.8 R10.2 ; 61.95,13.6 66.3,13.6 68.3,15.6 68.3,23.1 66.6,24.8 v1(51.1,24.8)
  vias: v3(44.7,26) v3(44.8,27.9) v3(45.3,26.9) v3(45.73,26) v3(45.8,27.9) v3(46.2,26.9) v3(46.8,27.9) v3(47.18,26.9) v3(47.74,27.9) v3(47.77,26) v3(48.1,26.9)
G+: length 52.5
  Top Layer w0.3: 17.3,11.2 v4(17.3,16.69) v4(17.3,22.09) v4(17.3,27.49) v4(17.3,32.89)
  Bottom Layer w0.3: 25.63,15.2 25.21,15.2 24.7,14.7 24.7,11.91 23.98,11.19 17.41,11.19 v4(17.3,11.29) U7.4 ; 25.63,15.2 25.6,15.17 25.6,13.75 ; 25.63,15.2 32.71,15.2 33.31,14.6 33.31,13.05 33.1,12.84 U2.7 ; U5.4 v4(17.3,22.09) ; U3.4 v4(17.3,32.89) ; U4.4 v4(17.3,27.49) ; U6.4 v4(17.3,16.69)
G-: length 50.1
  Top Layer w0.3: v1(17.2,10.1) 17.16,10.14 17.16,10.2 14.8,10.2 14.5,10.5 v4(14.5,13.8) v4(14.5,19.23) v4(14.5,24.6) v4(14.5,30) v4(14.5,35.5) ; v1(24.3,10.2) v4(29.5,10.2)
  Bottom Layer w0.3: v4(14.5,24.6) 16.01,24.6 U5.2 ; v1(24.3,10.2) 17.3,10.2 v1(17.2,10.1) ; v4(14.5,13.8) 16.01,13.8 U7.2 ; v4(14.5,35.5) 15.98,35.5 U3.2 ; v4(29.5,10.2) 29.6,10.3 U2.5 ; U4.2 16.01,30 v4(14.5,30) ; U6.2 v4(14.5,19.23)
$1N2288: length 17.1
  Top Layer w0.3: v4(33.4,15.5) v4(37.4,15.5)
  Bottom Layer w0.3: v4(37.4,15.5) 37.4,17.8 37.19,18.01 R15.1 ; v4(33.4,15.5) 33.11,15.79 27.71,15.79 27.5,16 27.5,17.7 27.34,17.86 U1.6
$1N2305: length 7.8
  Bottom Layer w0.3: U1.2 34.55,19.13 34.63,19.05 ; 34.63,18.05 34.67,18 35.13,18 35.34,17.79 35.34,16.66 35.49,16.51 R16.1 ; 34.63,18.05 34.63,19.05 ; 34.63,18.05 R15.2 ; C16.2 34.63,19.05
$1N2914: length 14
  Bottom Layer w0.3: 28.61,14.11 C19.1 ; 28.61,14.11 27.1,14.11 26.89,13.89 26.89,8.91 27.1,8.7 30.08,8.7 D2.1 ; 28.61,14.11 U2.8
$1N2918: length 4.2
  Bottom Layer w0.3: U2.6 31.48,11.5 28.4,11.5 28.19,11.71 28.19,12.29 C19.2
$1N2923: length 2.1
  Bottom Layer w0.3: R17.2 LED1.2
$1N3078: length 21
  Bottom Layer w0.6: 19.3,28.77 U4.3 13.84,28.77 13.5,29.1 13.5,30.88 13.08,31.3 10.57,31.3 10.56,31.3 ; 19.3,28.77 19.3,27.89 C3.1 C4.1 ; 19.3,28.77 C2.2 C1.2 ; 13.3,30 13.27,30.03 10.56,30.03
$1N3116: length 21.1
  Bottom Layer w0.6: 10.56,25.91 13,25.91 13.4,25.5 13.4,24.61 ; C6.1 C5.1 19.4,23.42 ; 13.4,24.61 13.4,23.8 13.83,23.38 16.03,23.38 U5.3 19.34,23.36 19.4,23.42 ; 13.4,24.61 13.38,24.63 10.56,24.63 ; 19.4,23.42 C3.2 C4.2
$1N3154: length 21
  Bottom Layer w0.6: 19.4,17.95 C5.2 C6.2 ; 19.4,17.95 19.39,17.96 U6.3 16.03,17.98 13.83,17.98 13.4,18.4 13.4,19.18 ; 19.4,17.95 C7.1 C8.1 ; 10.56,19.23 13.35,19.23 13.4,19.18 ; 10.56,20.5 13,20.5 13.4,20.1 13.4,19.18
$1N3504: length 16.5
  Bottom Layer w0.6: 13.5,13.78 13.45,13.83 10.56,13.83 ; 13.5,13.78 13.5,14.7 13.1,15.1 10.56,15.1 ; 13.5,13.78 13.5,13.12 14.06,12.56 U7.3 18.66,12.56 C7.2 C8.2
$1N4623: length 16.5
  Bottom Layer w0.6: 13.4,35.15 13.4,34.6 13.84,34.16 U3.3 21.13,34.16 C1.1 ; 13.4,35.15 13.11,35.43 10.56,35.43 ; 13.4,35.15 13.4,36.3 12.98,36.72 10.58,36.72 10.56,36.7
$1N5005: length 10.6
  Top Layer w0.3: v1(55.1,22.4) 55.1,18.8 54.9,18.6 v1(50.9,18.6)
  Bottom Layer w0.3: U8.8 50.73,18.43 v1(50.9,18.6) ; v1(55.1,22.4) C26.2
$1N5133: length 3.8
  Bottom Layer w0.3: R1.2 48.89,10.35 C25.2 48.89,13.72 U8.1
$1N5140: length 5.1
  Top Layer w0.3: v1(51.1,10.29) v1(54.4,10.29)
  Bottom Layer w0.3: D3.1 54.4,10.3 v1(54.4,10.29) ; R1.1 v1(51.1,10.29)
$1N5163: length 8.7
  Bottom Layer w0.3: 44.28,10.3 44.3,10.32 C24.2 44.32,11.89 46.29,11.89 46.81,12.41 46.81,14.31 47.11,14.61 U8.2
$1N5170: length 7.8
  Bottom Layer w0.3: U8.3 46.2,15.25 45.95,14.99 45.95,13.96 45.48,13.49 44.29,13.49 44.28,13.5 44.3,13.52 C23.2
$1N5177: length 7.2
  Bottom Layer w0.3: C22.2 44.28,18.28 44.28,16.7 44.4,16.81 45.39,16.81 45.6,16.6 45.6,16 45.72,15.88 U8.4
$1N5184: length 9.7
  Bottom Layer w0.3: U8.5 46.28,16.52 46.2,16.6 46.2,19.7 45.99,19.91 44.3,19.91 44.28,19.9 44.28,21.48 C21.2
$1N5194: length 9.7
  Bottom Layer w0.3: U8.6 47.11,17.15 46.9,17.37 46.9,21.2 47.2,21.5 48.7,21.5 48.7,19.95 48.65,19.9
$1N5371: length 1.6
  Bottom Layer w0.3: C27.2 55.1,18.66 U8.9
$1N5430: length 7.3
  Bottom Layer w0.3: U8.10 56.89,17.79 56.9,17.8 56.9,19.3 57.6,20 60.4,20
$1N5516: length 6.7
  Bottom Layer w0.3: U8.12 58.1,16.52 58.4,16.82 58.4,17.8 58.7,18.1 R7.1
$1N5520: length 14.2
  Bottom Layer w0.3: U8.11 57.55,17.15 57.6,17.2 57.6,18.6 58,19 61.8,19 62.01,18.79 62.01,18.26 R7.2 65.65,18.1 R18.2
$1N5630: length 31.2
  Top Layer w0.3: v1(63.8,16.6) 69,16.6
  Bottom Layer w0.3: R8.1 v1(63.8,16.6) ; 61.9,30.42 61.9,32.2 68.3,32.2 69.05,31.45 v1(69.05,16.6)
$1N5637: length 6
  Bottom Layer w0.3: U8.13 58.68,15.88 59.61,16.81 60.11,16.81 60.33,16.6 R8.2
$1N5652: length 35.8
  Bottom Layer w0.3: 61.95,15.1 66.4,15.1 67.5,16.2 67.5,22.6 66,24.1 50.01,24.1 49.8,24.31 49.8,29.13 Q2.4
$1N5657: length 5.6
  Bottom Layer w0.3: 60.45,15.1 60.3,15.25 U8.14
$1N5714: length 2.4
  Bottom Layer w0.3: Q2.8 55.83,35.22 R12.1
$1N5821: length 27.1
  Top Layer w0.3: v1(53,14.7) 49.2,14.7 48.9,15 48.9,23.3 48.5,23.7 43.5,23.7 43.29,23.91 43.29,24.69 v1(43.3,24.7)
  Bottom Layer w0.3: Q1.4 43.24,24.56 43.6,24.2 R10.1 ; U8.15 53.09,14.61 v1(53,14.7)
$1N5879: length 5.7
  Bottom Layer w0.3: U8.16 60.07,13.97 60.45,13.6
$1N6186: length 11.8
  Bottom Layer w0.6: D1.2 11.65,9.65 11.3,10 5.9,10 5.3,10.61 SW1.1
$1N7988: length 14.2
  Bottom Layer w0.3: 34.39,12.9 34.39,16.31 ; 34.39,12.9 34.39,11.78 34.6,11.57 U2.3 ; 34.39,12.9 34.45,12.84 U2.2 ; 34.39,16.31 34.3,16.4 33.41,16.4 33.2,16.61 33.2,17.8 33.14,17.86 U1.3 ; 34.39,16.31 R16.2
$1N8013: length 35.8
  Top Layer w0.3: v2(26.1,22.2) 26.1,13.6 23.6,11.1 v1(23.6,9.3)
  Bottom Layer w0.3: v1(23.6,9.3) 18.8,9.3 17.9,8.4 D1.1 ; U1.4 28.31,16.59 28.1,16.81 28.1,22.1 28,22.2 v2(26.1,22.2) 26,22.1 26,20.47 U1.8

## Copper pours and planes (outline as drawn; the poured copper is in the pictures)
B5+ on Top Layer: 20.7,6 41.1,6 41.1,0.4 20.7,0.4
B- on Bottom Layer: 57.05,44.95 65,44.95 65,33.8 57.05,33.8
C- on Top Layer: 21.2,46.1 48.7,46.1 48.7,25.6 21.2,25.6
C- on Bottom Layer: 44.1,29.5 48.7,29.5 48.7,25.6 44.1,25.6
$1N5630 on Bottom Layer: 50.7,29.6 65.7,29.6 65.7,25.5 50.7,25.5
$1N5630 on Bottom Layer: 54.7,31.73 65.7,31.73 65.7,28.3 54.7,28.3
$1N5714 on Bottom Layer: 43.2,34.5 53.4,34.5 53.4,30.6 43.2,30.6

## Text on the board
Top Silkscreen Layer: 牧田款工具电池主动均衡保护板 | 文宇创新_志文 2024-7-14
